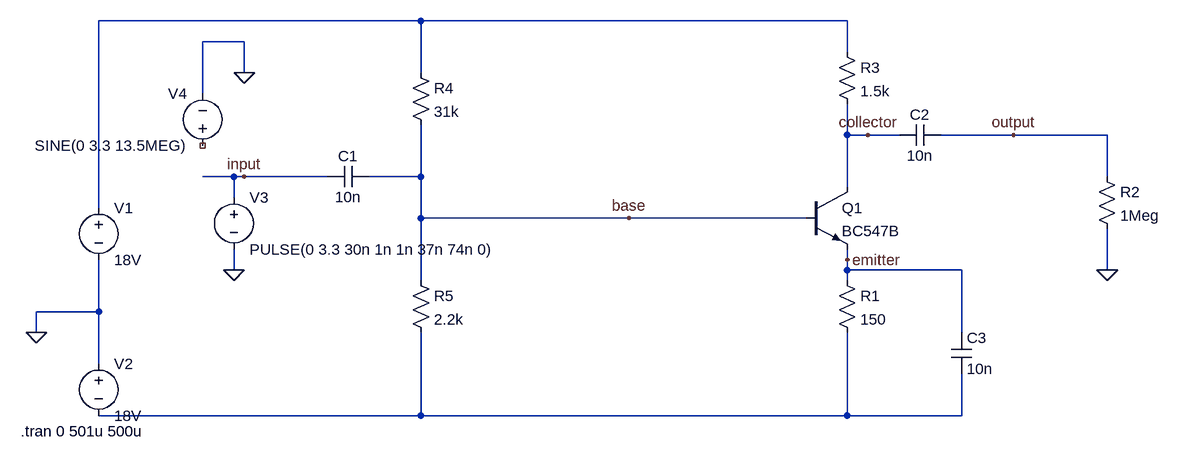
[diagram p0: schematic bc447_amp.asc]
bc447_amp.asc, the LTspice schematic file:
Version 4
SHEET 1 880 680
WIRE -496 -272 -992 -272
WIRE 160 -272 -496 -272
WIRE -768 -240 -832 -240
WIRE 160 -224 160 -272
WIRE -768 -192 -768 -240
WIRE -496 -192 -496 -272
WIRE -832 -160 -832 -240
WIRE 160 -96 160 -144
WIRE 192 -96 160 -96
WIRE 240 -96 192 -96
WIRE 416 -96 304 -96
WIRE 560 -96 416 -96
WIRE -784 -32 -832 -32
WIRE -768 -32 -784 -32
WIRE -640 -32 -768 -32
WIRE -496 -32 -496 -112
WIRE -496 -32 -576 -32
WIRE 560 -32 560 -96
WIRE 160 -16 160 -96
WIRE -784 0 -784 -32
WIRE -992 16 -992 -272
WIRE -496 32 -496 -32
WIRE -176 32 -496 32
WIRE 96 32 -176 32
WIRE 160 96 160 80
WIRE -784 112 -784 80
WIRE 160 112 160 96
WIRE 336 112 160 112
WIRE 560 112 560 48
WIRE -496 128 -496 32
WIRE 160 128 160 112
WIRE -992 176 -992 96
WIRE -992 176 -1088 176
WIRE -1088 208 -1088 176
WIRE 336 208 336 112
WIRE -992 256 -992 176
WIRE -496 336 -496 208
WIRE -496 336 -992 336
WIRE 160 336 160 208
WIRE 160 336 -496 336
WIRE 336 336 336 272
WIRE 336 336 160 336
FLAG -1088 208 0
FLAG -768 -32 input
FLAG 560 112 0
FLAG 416 -96 output
FLAG -784 112 0
FLAG 192 -96 collector
FLAG -176 32 base
FLAG 160 96 emitter
FLAG -768 -192 0
SYMBOL npn 96 -16 R0
SYMATTR InstName Q1
SYMATTR Value BC547B
SYMBOL res 144 112 R0
SYMATTR InstName R1
SYMATTR Value 150
SYMBOL voltage -992 0 R0
WINDOW 123 0 0 Left 2
WINDOW 39 0 0 Left 2
SYMATTR InstName V1
SYMATTR Value 18V
SYMBOL voltage -992 240 R0
WINDOW 123 0 0 Left 2
WINDOW 39 0 0 Left 2
SYMATTR InstName V2
SYMATTR Value 18V
SYMBOL voltage -784 -16 R0
WINDOW 123 0 0 Left 2
WINDOW 39 0 0 Left 2
SYMATTR InstName V3
SYMATTR Value PULSE(0 3.3 30n 1n 1n 37n 74n 0)
SYMBOL res 144 -240 R0
SYMATTR InstName R3
SYMATTR Value 1.5k
SYMBOL res 544 -48 R0
SYMATTR InstName R2
SYMATTR Value 1Meg
SYMBOL res -512 -208 R0
SYMATTR InstName R4
SYMATTR Value 31k
SYMBOL res -512 112 R0
SYMATTR InstName R5
SYMATTR Value 2.2k
SYMBOL cap -576 -48 R90
WINDOW 0 0 32 VBottom 2
WINDOW 3 32 32 VTop 2
SYMATTR InstName C1
SYMATTR Value 10n
SYMBOL cap 304 -112 R90
WINDOW 0 0 32 VBottom 2
WINDOW 3 32 32 VTop 2
SYMATTR InstName C2
SYMATTR Value 10n
SYMBOL voltage -832 -64 R180
WINDOW 0 24 96 Left 2
WINDOW 3 24 16 Left 2
WINDOW 123 0 0 Left 2
WINDOW 39 0 0 Left 2
SYMATTR InstName V4
SYMATTR Value SINE(0 3.3 13.5MEG)
SYMBOL cap 320 208 R0
SYMATTR InstName C3
SYMATTR Value 10n
TEXT -1112 360 Left 2 !.tran 0 501u 500u

The netlist it stands for:
* bc447_amp.asc
Q1 collector base emitter 0 BC547B
R1 emitter N002 150
V1 N001 0 18V
V2 0 N002 18V
V3 input 0 PULSE(0 3.3 30n 1n 1n 37n 74n 0)
R3 N001 collector 1.5k
R2 output 0 1Meg
R4 N001 base 31k
R5 base N002 2.2k
C1 base input 10n
C2 output collector 10n
V4 NC_01 0 SINE(0 3.3 13.5MEG)
C3 emitter N002 10n
.model NPN NPN
.model PNP PNP
.lib standard.bjt
.tran 0 501u 500u
.backanno
.end